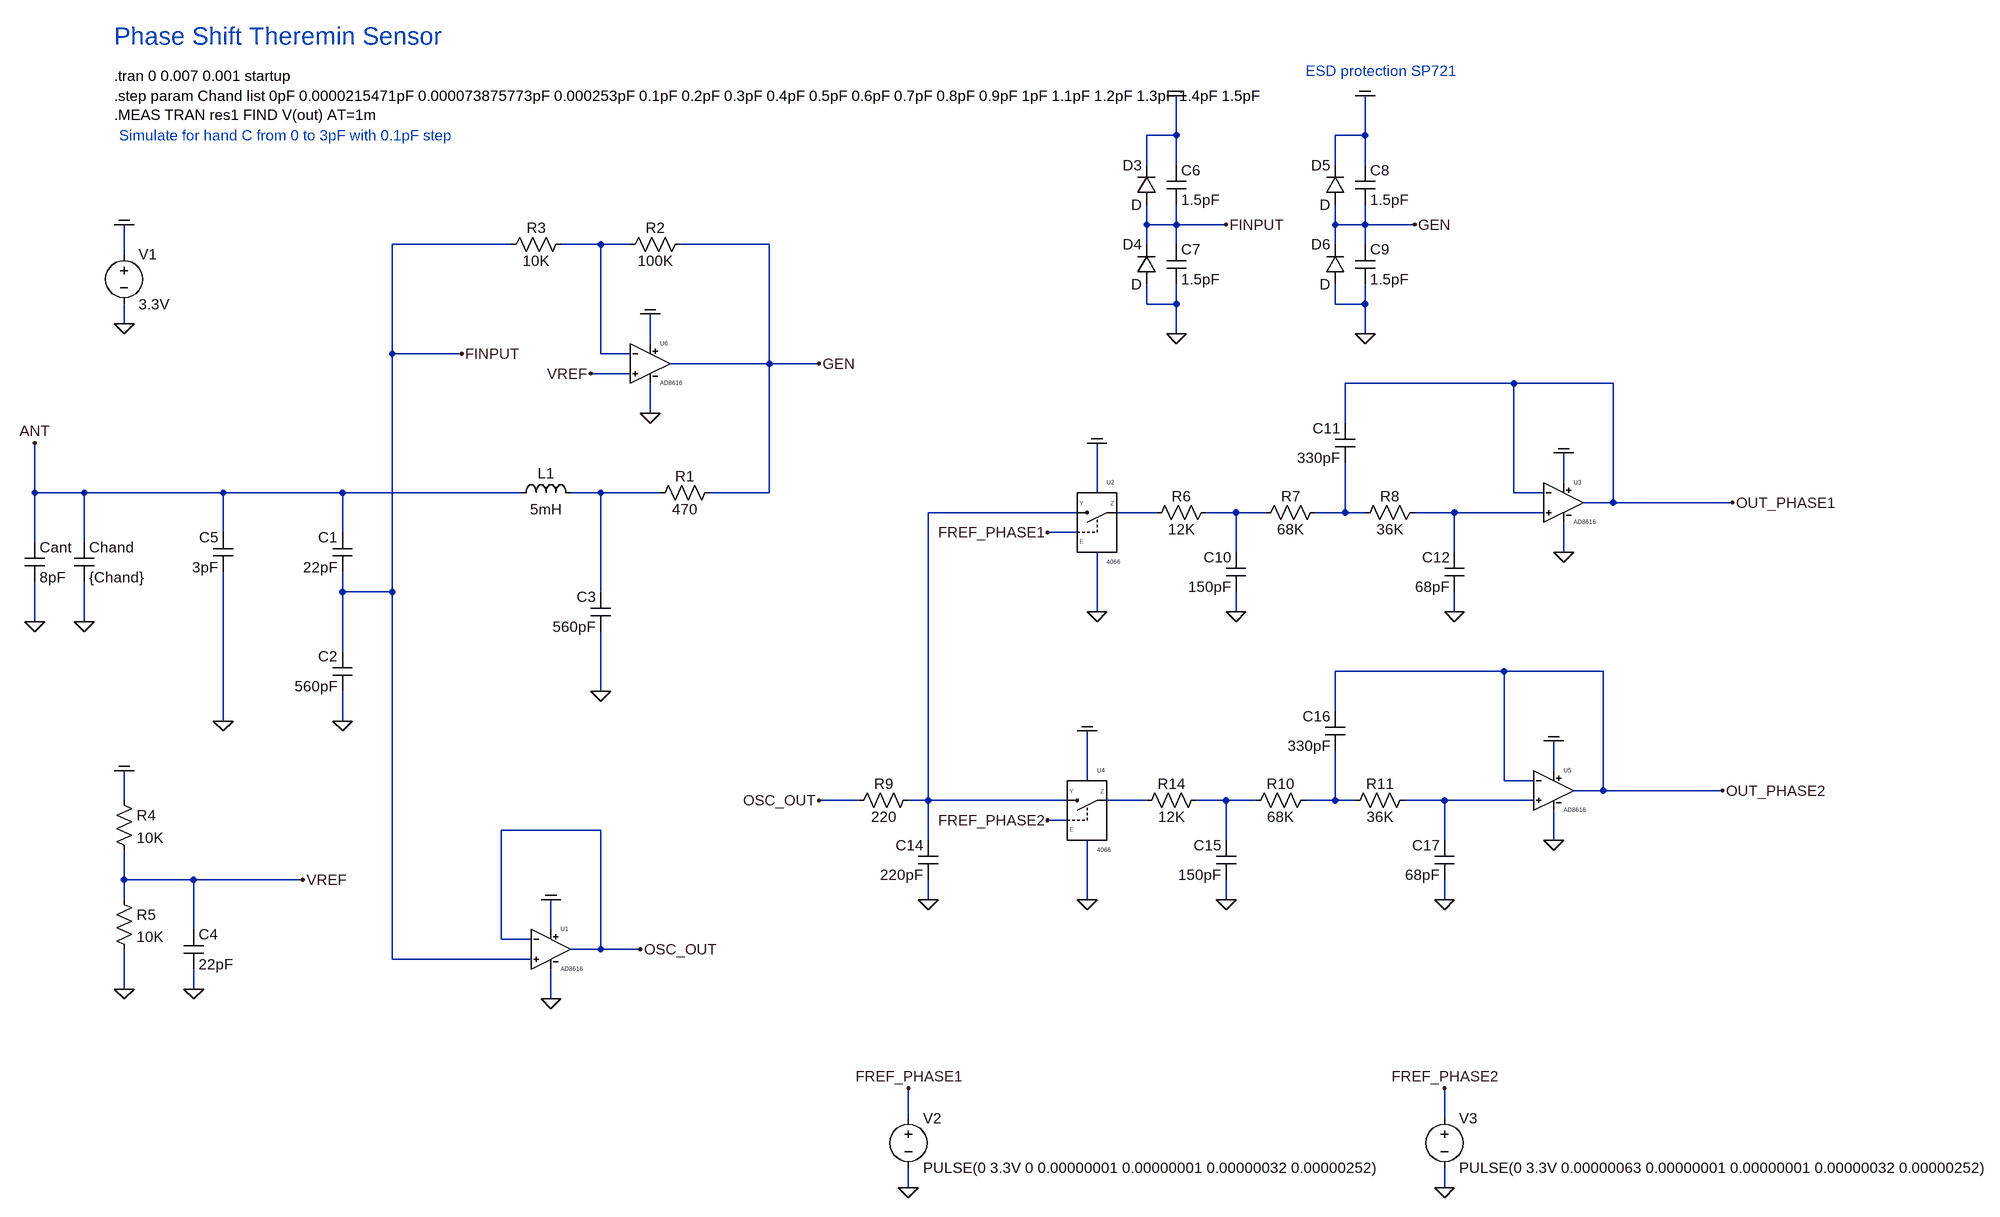
[diagram p0: schematic sin_osc_opamp_v1.asc]
sin_osc_opamp_v1.asc, the LTspice schematic file:
Version 4
SHEET 1 3724 1732
WIRE 1744 -208 1744 -272
WIRE 1744 -208 1696 -208
WIRE 2048 -208 2048 -272
WIRE 2048 -208 2000 -208
WIRE 1696 -160 1696 -208
WIRE 1744 -160 1744 -208
WIRE 2000 -160 2000 -208
WIRE 2048 -160 2048 -208
WIRE 1696 -64 1696 -96
WIRE 1744 -64 1744 -96
WIRE 1744 -64 1696 -64
WIRE 1824 -64 1744 -64
WIRE 2000 -64 2000 -96
WIRE 2048 -64 2048 -96
WIRE 2048 -64 2000 -64
WIRE 2128 -64 2048 -64
WIRE 672 -32 480 -32
WIRE 816 -32 752 -32
WIRE 864 -32 816 -32
WIRE 1088 -32 944 -32
WIRE 1696 -32 1696 -64
WIRE 1744 -32 1744 -64
WIRE 2000 -32 2000 -64
WIRE 2048 -32 2048 -64
WIRE 48 -16 48 -64
WIRE 1696 64 1696 32
WIRE 1744 64 1744 32
WIRE 1744 64 1696 64
WIRE 2000 64 2000 32
WIRE 2048 64 2048 32
WIRE 2048 64 2000 64
WIRE 48 96 48 64
WIRE 1744 112 1744 64
WIRE 2048 112 2048 64
WIRE 896 128 896 80
WIRE 480 144 480 -32
WIRE 592 144 480 144
WIRE 816 144 816 -32
WIRE 864 144 816 144
WIRE 1088 160 1088 -32
WIRE 1088 160 928 160
WIRE 1168 160 1088 160
WIRE 864 176 800 176
WIRE 2288 192 2016 192
WIRE 2448 192 2288 192
WIRE 896 240 896 192
WIRE 2016 256 2016 192
WIRE 2368 352 2368 304
WIRE -96 368 -96 288
WIRE -16 368 -96 368
WIRE 208 368 -16 368
WIRE 400 368 208 368
WIRE 688 368 400 368
WIRE 816 368 768 368
WIRE 912 368 816 368
WIRE 1088 368 1088 160
WIRE 1088 368 992 368
WIRE 1616 368 1616 288
WIRE 2288 368 2288 192
WIRE 2336 368 2288 368
WIRE 2448 384 2448 192
WIRE 2448 384 2400 384
WIRE 2640 384 2448 384
WIRE 1584 400 1344 400
WIRE 1712 400 1648 400
WIRE 1840 400 1792 400
WIRE 1888 400 1840 400
WIRE 2016 400 2016 320
WIRE 2016 400 1968 400
WIRE 2048 400 2016 400
WIRE 2192 400 2128 400
WIRE 2336 400 2192 400
WIRE 208 432 208 368
WIRE 400 432 400 368
WIRE 1584 432 1536 432
WIRE -96 448 -96 368
WIRE -16 448 -16 368
WIRE 1840 464 1840 400
WIRE 2192 464 2192 400
WIRE 2368 464 2368 416
WIRE 400 528 400 496
WIRE 480 528 480 144
WIRE 480 528 400 528
WIRE 816 528 816 368
WIRE 1616 560 1616 464
WIRE 1840 560 1840 528
WIRE 2192 560 2192 528
WIRE -96 576 -96 512
WIRE -16 576 -16 512
WIRE 400 624 400 528
WIRE 2272 656 2000 656
WIRE 2432 656 2272 656
WIRE 816 688 816 592
WIRE 2000 720 2000 656
WIRE 208 736 208 496
WIRE 400 736 400 688
WIRE 2352 816 2352 768
WIRE 1600 832 1600 752
WIRE 2272 832 2272 656
WIRE 2320 832 2272 832
WIRE 2432 848 2432 656
WIRE 2432 848 2384 848
WIRE 2624 848 2432 848
WIRE 48 864 48 816
WIRE 1232 864 1168 864
WIRE 1344 864 1344 400
WIRE 1344 864 1312 864
WIRE 1568 864 1344 864
WIRE 1696 864 1632 864
WIRE 1824 864 1776 864
WIRE 1872 864 1824 864
WIRE 2000 864 2000 784
WIRE 2000 864 1952 864
WIRE 2032 864 2000 864
WIRE 2176 864 2112 864
WIRE 2320 864 2176 864
WIRE 1568 896 1536 896
WIRE 816 912 656 912
WIRE 1344 928 1344 864
WIRE 1824 928 1824 864
WIRE 2176 928 2176 864
WIRE 2352 928 2352 880
WIRE 48 992 48 944
WIRE 160 992 48 992
WIRE 336 992 160 992
WIRE 48 1024 48 992
WIRE 1344 1024 1344 992
WIRE 1600 1024 1600 928
WIRE 1824 1024 1824 992
WIRE 2176 1024 2176 992
WIRE 160 1072 160 992
WIRE 736 1072 736 1024
WIRE 656 1088 656 912
WIRE 704 1088 656 1088
WIRE 816 1104 816 912
WIRE 816 1104 768 1104
WIRE 880 1104 816 1104
WIRE 480 1120 480 528
WIRE 704 1120 480 1120
WIRE 48 1168 48 1104
WIRE 160 1168 160 1136
WIRE 736 1184 736 1136
WIRE 1312 1376 1312 1328
WIRE 2176 1376 2176 1328
WIRE 1312 1488 1312 1456
WIRE 2176 1488 2176 1456
FLAG 48 96 0
FLAG -96 288 ANT
FLAG -96 576 0
FLAG -16 576 0
FLAG 48 -64 COM
FLAG 1744 112 0
FLAG 1744 -272 COM
FLAG 1824 -64 FINPUT
FLAG 2048 112 0
FLAG 2048 -272 COM
FLAG 2128 -64 GEN
FLAG 896 240 0
FLAG 1168 160 GEN
FLAG 48 1168 0
FLAG 48 816 COM
FLAG 336 992 VREF
FLAG 160 1168 0
FLAG 896 80 COM
FLAG 800 176 VREF
FLAG 400 736 0
FLAG 816 688 0
FLAG 592 144 FINPUT
FLAG 736 1184 0
FLAG 736 1024 COM
FLAG 880 1104 OSC_OUT
FLAG 208 736 0
FLAG 1312 1488 0
FLAG 1600 1024 0
FLAG 1600 752 COM
FLAG 1824 1024 0
FLAG 2176 1024 0
FLAG 2352 928 0
FLAG 2352 768 COM
FLAG 2624 848 OUT_PHASE2
FLAG 1312 1328 FREF_PHASE1
FLAG 1536 896 FREF_PHASE2
FLAG 1168 864 OSC_OUT
FLAG 2176 1488 0
FLAG 2176 1328 FREF_PHASE2
FLAG 1616 560 0
FLAG 1616 288 COM
FLAG 1840 560 0
FLAG 2192 560 0
FLAG 2368 464 0
FLAG 2368 304 COM
FLAG 2640 384 OUT_PHASE1
FLAG 1536 432 FREF_PHASE1
FLAG 1344 1024 0
SYMBOL voltage 48 -32 R0
WINDOW 123 0 0 Left 2
WINDOW 39 0 0 Left 2
SYMATTR InstName V1
SYMATTR Value 3.3V
SYMBOL ind 672 384 R270
WINDOW 0 32 56 VTop 2
WINDOW 3 5 56 VBottom 2
SYMATTR InstName L1
SYMATTR Value 5mH
SYMATTR SpiceLine Ipk=0.1 Rser=271 Rpar=22Meg Cpar=1.419pF
SYMBOL cap -112 448 R0
SYMATTR InstName Cant
SYMATTR Value 8pF
SYMBOL cap -32 448 R0
SYMATTR InstName Chand
SYMATTR Value {Chand}
SYMBOL res 1008 352 R90
WINDOW 0 5 56 VBottom 2
WINDOW 3 27 56 VTop 2
SYMATTR InstName R1
SYMATTR Value 470
SYMBOL cap 416 496 R180
WINDOW 0 24 56 Left 2
WINDOW 3 24 8 Left 2
SYMATTR InstName C1
SYMATTR Value 22pF
SYMBOL diode 1712 -96 R180
WINDOW 0 24 64 Left 2
WINDOW 3 24 0 Left 2
SYMATTR InstName D3
SYMBOL diode 1712 32 R180
WINDOW 0 24 64 Left 2
WINDOW 3 24 0 Left 2
SYMATTR InstName D4
SYMBOL cap 1728 -160 R0
SYMATTR InstName C6
SYMATTR Value 1.5pF
SYMBOL cap 1728 -32 R0
SYMATTR InstName C7
SYMATTR Value 1.5pF
SYMBOL diode 2016 -96 R180
WINDOW 0 24 64 Left 2
WINDOW 3 24 0 Left 2
SYMATTR InstName D5
SYMBOL diode 2016 32 R180
WINDOW 0 24 64 Left 2
WINDOW 3 24 0 Left 2
SYMATTR InstName D6
SYMBOL cap 2032 -160 R0
SYMATTR InstName C8
SYMATTR Value 1.5pF
SYMBOL cap 2032 -32 R0
SYMATTR InstName C9
SYMATTR Value 1.5pF
SYMBOL EXTRA\\AudioOpamp\\AD\\AD8616 896 160 R0
SYMATTR InstName U6
SYMBOL cap 832 592 R180
WINDOW 0 24 56 Left 2
WINDOW 3 24 8 Left 2
SYMATTR InstName C3
SYMATTR Value 560pF
SYMBOL res 960 -48 R90
WINDOW 0 5 56 VBottom 2
WINDOW 3 27 56 VTop 2
SYMATTR InstName R2
SYMATTR Value 100K
SYMBOL res 768 -48 R90
WINDOW 0 5 56 VBottom 2
WINDOW 3 27 56 VTop 2
SYMATTR InstName R3
SYMATTR Value 10K
SYMBOL res 32 848 R0
SYMATTR InstName R4
SYMATTR Value 10K
SYMBOL res 32 1008 R0
SYMATTR InstName R5
SYMATTR Value 10K
SYMBOL cap 144 1072 R0
SYMATTR InstName C4
SYMATTR Value 22pF
SYMBOL cap 416 688 R180
WINDOW 0 24 56 Left 2
WINDOW 3 24 8 Left 2
SYMATTR InstName C2
SYMATTR Value 560pF
SYMBOL EXTRA\\AudioOpamp\\AD\\AD8616 736 1104 R0
SYMATTR InstName U1
SYMBOL cap 224 496 R180
WINDOW 0 24 56 Left 2
WINDOW 3 24 8 Left 2
SYMATTR InstName C5
SYMATTR Value 3pF
SYMBOL voltage 1312 1360 R0
WINDOW 123 0 0 Left 2
WINDOW 39 0 0 Left 2
SYMATTR InstName V2
SYMATTR Value PULSE(0 3.3V 0 0.00000001 0.00000001 0.00000032 0.00000252)
SYMBOL Dig_Add\\CD4xxx\\cd4066 1600 880 R0
SYMATTR InstName U4
SYMBOL res 1328 848 R90
WINDOW 0 5 56 VBottom 2
WINDOW 3 27 56 VTop 2
SYMATTR InstName R9
SYMATTR Value 220
SYMBOL res 1968 848 R90
WINDOW 0 5 56 VBottom 2
WINDOW 3 27 56 VTop 2
SYMATTR InstName R10
SYMATTR Value 68K
SYMBOL res 2128 848 R90
WINDOW 0 5 56 VBottom 2
WINDOW 3 27 56 VTop 2
SYMATTR InstName R11
SYMATTR Value 36K
SYMBOL cap 1840 992 R180
WINDOW 0 24 56 Left 2
WINDOW 3 24 8 Left 2
SYMATTR InstName C15
SYMATTR Value 150pF
SYMBOL cap 2016 784 R180
WINDOW 0 24 56 Left 2
WINDOW 3 24 8 Left 2
SYMATTR InstName C16
SYMATTR Value 330pF
SYMBOL cap 2192 992 R180
WINDOW 0 24 56 Left 2
WINDOW 3 24 8 Left 2
SYMATTR InstName C17
SYMATTR Value 68pF
SYMBOL EXTRA\\AudioOpamp\\AD\\AD8616 2352 848 R0
SYMATTR InstName U5
SYMBOL voltage 2176 1360 R0
WINDOW 123 0 0 Left 2
WINDOW 39 0 0 Left 2
SYMATTR InstName V3
SYMATTR Value PULSE(0 3.3V 0.00000063 0.00000001 0.00000001 0.00000032 0.00000252)
SYMBOL Dig_Add\\CD4xxx\\cd4066 1616 416 R0
SYMATTR InstName U2
SYMBOL res 1808 384 R90
WINDOW 0 5 56 VBottom 2
WINDOW 3 27 56 VTop 2
SYMATTR InstName R6
SYMATTR Value 12K
SYMBOL res 1984 384 R90
WINDOW 0 5 56 VBottom 2
WINDOW 3 27 56 VTop 2
SYMATTR InstName R7
SYMATTR Value 68K
SYMBOL res 2144 384 R90
WINDOW 0 5 56 VBottom 2
WINDOW 3 27 56 VTop 2
SYMATTR InstName R8
SYMATTR Value 36K
SYMBOL cap 1856 528 R180
WINDOW 0 24 56 Left 2
WINDOW 3 24 8 Left 2
SYMATTR InstName C10
SYMATTR Value 150pF
SYMBOL cap 2032 320 R180
WINDOW 0 24 56 Left 2
WINDOW 3 24 8 Left 2
SYMATTR InstName C11
SYMATTR Value 330pF
SYMBOL cap 2208 528 R180
WINDOW 0 24 56 Left 2
WINDOW 3 24 8 Left 2
SYMATTR InstName C12
SYMATTR Value 68pF
SYMBOL EXTRA\\AudioOpamp\\AD\\AD8616 2368 384 R0
SYMATTR InstName U3
SYMBOL res 1792 848 R90
WINDOW 0 5 56 VBottom 2
WINDOW 3 27 56 VTop 2
SYMATTR InstName R14
SYMATTR Value 12K
SYMBOL cap 1360 992 R180
WINDOW 0 24 56 Left 2
WINDOW 3 24 8 Left 2
SYMATTR InstName C14
SYMATTR Value 220pF
TEXT 32 -304 Left 2 !.tran 0 0.007 0.001 startup
TEXT 32 -272 Left 2 !.step param Chand list 0pF 0.0000215471pF 0.000073875773pF 0.000253pF 0.1pF 0.2pF 0.3pF 0.4pF 0.5pF 0.6pF 0.7pF 0.8pF 0.9pF 1pF 1.1pF 1.2pF 1.3pF 1.4pF 1.5pF\n.MEAS TRAN res1 FIND V(out) AT=1m
TEXT 32 -368 Left 4 ;Phase Shift Theremin Sensor
TEXT 1952 -312 Left 2 ;ESD protection SP721
TEXT 40 -208 Left 2 ;Simulate for hand C from 0 to 3pF with 0.1pF step

The netlist it stands for:
* sin_osc_opamp_v1.asc
V1 COM 0 3.3V
L1 ANT N002 5mH Ipk=0.1 Rser=271 Rpar=22Meg Cpar=1.419pF
Cant ANT 0 8pF
Chand ANT 0 {Chand}
R1 GEN N002 470
C1 FINPUT ANT 22pF
D3 FINPUT COM D
D4 0 FINPUT D
C6 COM FINPUT 1.5pF
C7 FINPUT 0 1.5pF
D5 GEN COM D
D6 0 GEN D
C8 COM GEN 1.5pF
C9 GEN 0 1.5pF
XU6 VREF N001 COM 0 GEN AD8616  ; pins In+ In- V+ V- OUT
C3 0 N002 560pF
R2 GEN N001 100K
R3 N001 FINPUT 10K
R4 COM VREF 10K
R5 VREF 0 10K
C4 VREF 0 22pF
C2 0 FINPUT 560pF
XU1 FINPUT OSC_OUT COM 0 OSC_OUT AD8616  ; pins In+ In- V+ V- OUT
C5 0 ANT 3pF
V2 FREF_PHASE1 0 PULSE(0 3.3V 0 0.00000001 0.00000001 0.00000032 0.00000252)
XU4 N003 N008 FREF_PHASE2 COM 0 4066  ; pins Y OUT EN VCC VSS
R9 N003 OSC_OUT 220
R10 N010 N009 68K
R11 N011 N010 36K
C15 0 N009 150pF
C16 N010 OUT_PHASE2 330pF
C17 0 N011 68pF
XU5 N011 OUT_PHASE2 COM 0 OUT_PHASE2 AD8616  ; pins In+ In- V+ V- OUT
V3 FREF_PHASE2 0 PULSE(0 3.3V 0.00000063 0.00000001 0.00000001 0.00000032 0.00000252)
XU2 N003 N004 FREF_PHASE1 COM 0 4066  ; pins Y OUT EN VCC VSS
R6 N005 N004 12K
R7 N006 N005 68K
R8 N007 N006 36K
C10 0 N005 150pF
C11 N006 OUT_PHASE1 330pF
C12 0 N007 68pF
XU3 N007 OUT_PHASE1 COM 0 OUT_PHASE1 AD8616  ; pins In+ In- V+ V- OUT
R14 N009 N008 12K
C14 0 N003 220pF
.model D D
.lib standard.dio
.tran 0 0.007 0.001 startup
.step param Chand list 0pF 0.0000215471pF 0.000073875773pF 0.000253pF 0.1pF 0.2pF 0.3pF 0.4pF 0.5pF 0.6pF 0.7pF 0.8pF 0.9pF 1pF 1.1pF 1.2pF 1.3pF 1.4pF 1.5pF
.MEAS TRAN res1 FIND V(out) AT=1m
* Phase Shift Theremin Sensor
* ESD protection SP721
* Simulate for hand C from 0 to 3pF with 0.1pF step
.lib AD8616.cir
.lib SwitchAna.lib
.backanno
.end